# Altium schematic sheet SPI.SchDoc: Temperature
size A4; Date: 04/19/2026; CheckedBy: DÉRONNE Mathis; Author: Lanfroid-Nazac Guillaume; DrawnBy: Lanfroid-Nazac Guillaume; Revision: v1.0; SheetNumber: 6; SheetTotal: 7
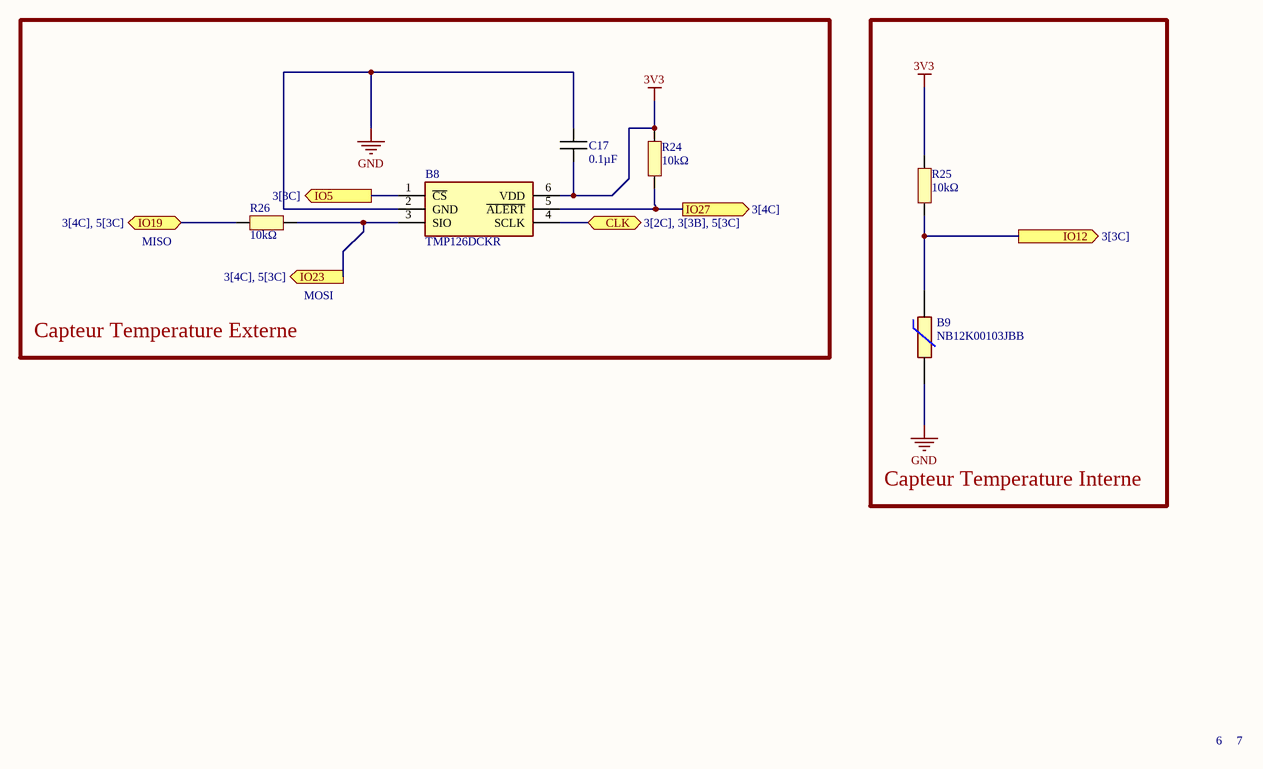
[diagram p0: SPI.SchDoc]

## Parts
B8  TMP126DCKR  [SOT65P210X110-6N]
B9  NB12K00103JBB  [RESC2212X50N]
C17  0.1µF  [CAPC1005X06N]
R24  10kΩ  [RESC1005X06N]
R25  10kΩ  [RESC1005X06N]
R26  10kΩ  [RESC1005X06N]

## Blocks framed on the sheet
Capteur Temperature Externe: B8 C17 R24 R26
Capteur Temperature Interne: B9 R25

## Ports
CLK (bidir, see 3[2C], 3[3B], 5[3C]), IO5 (out, see 3[3C]), IO12 (out, see 3[3C]), IO19 (bidir, see 3[4C], 5[3C]), IO23 (out, see 3[4C], 5[3C]), IO27 (out, see 3[4C])

## Nets
3V3: B8.6(VDD) C17.1 R24.2 R25.1
GND: B8.2(GND) B9.2 C17.2
CLK: B8.4(SCLK) ; port CLK
IO5: B8.1(~{CS}) ; port IO5
IO12: B9.1 R25.2 ; port IO12
IO19: R26.2 ; port IO19
IO23: B8.3(SIO) R26.1 ; port IO23
IO27: B8.5(~{ALERT}) R24.1 ; port IO27

## Notes on the sheet
- MISO
- MOSI
- 6
- 7

## Library data of the parts
B8 = TMP126DCKR: Board Mount Temperature Sensors +/-0.25 C SPI temperature sensor with 175 C operation, CRC and slew-rate alert; Manufacturer_Name: Texas Instruments; Manufacturer_Part_Number: TMP126DCKR; Mouser Part Number: 595-TMP126DCKR
B9 = NB12K00103JBB: NTC SMD Thermistor, NB12K, 10K, 5% AVX 10k 0805 Protection NTC Thermistor, 5s, 2 x 1.25 x 1.3mm; Manufacturer_Name: Kyocera AVX; Geometry.Height: 0.5mm; Manufacturer_Part_Number: NB12K00103JBB; Mouser Part Number: 581-NB12K00103JBB; Mouser Price/Stock: https://www.mouser.co.uk/ProductDetail/AVX/NB12K00103JBB/?qs=4%252B6%252BTdINQeDPvI%252BQUQjJ3Q%3D%3D; Arrow Part Number: NB12K00103JBB; Arrow Price/Stock: https://www.arrow.com/en/products/nb12k00103jbb/avx; Datasheet Link: https://datasheet.datasheetarchive.com/originals/distributors/Datasheets-DGA6/551314.pdf
C17 = Capacitor
R24-R26 = Resistor